# Altium project BT_BMS.PrjPcb
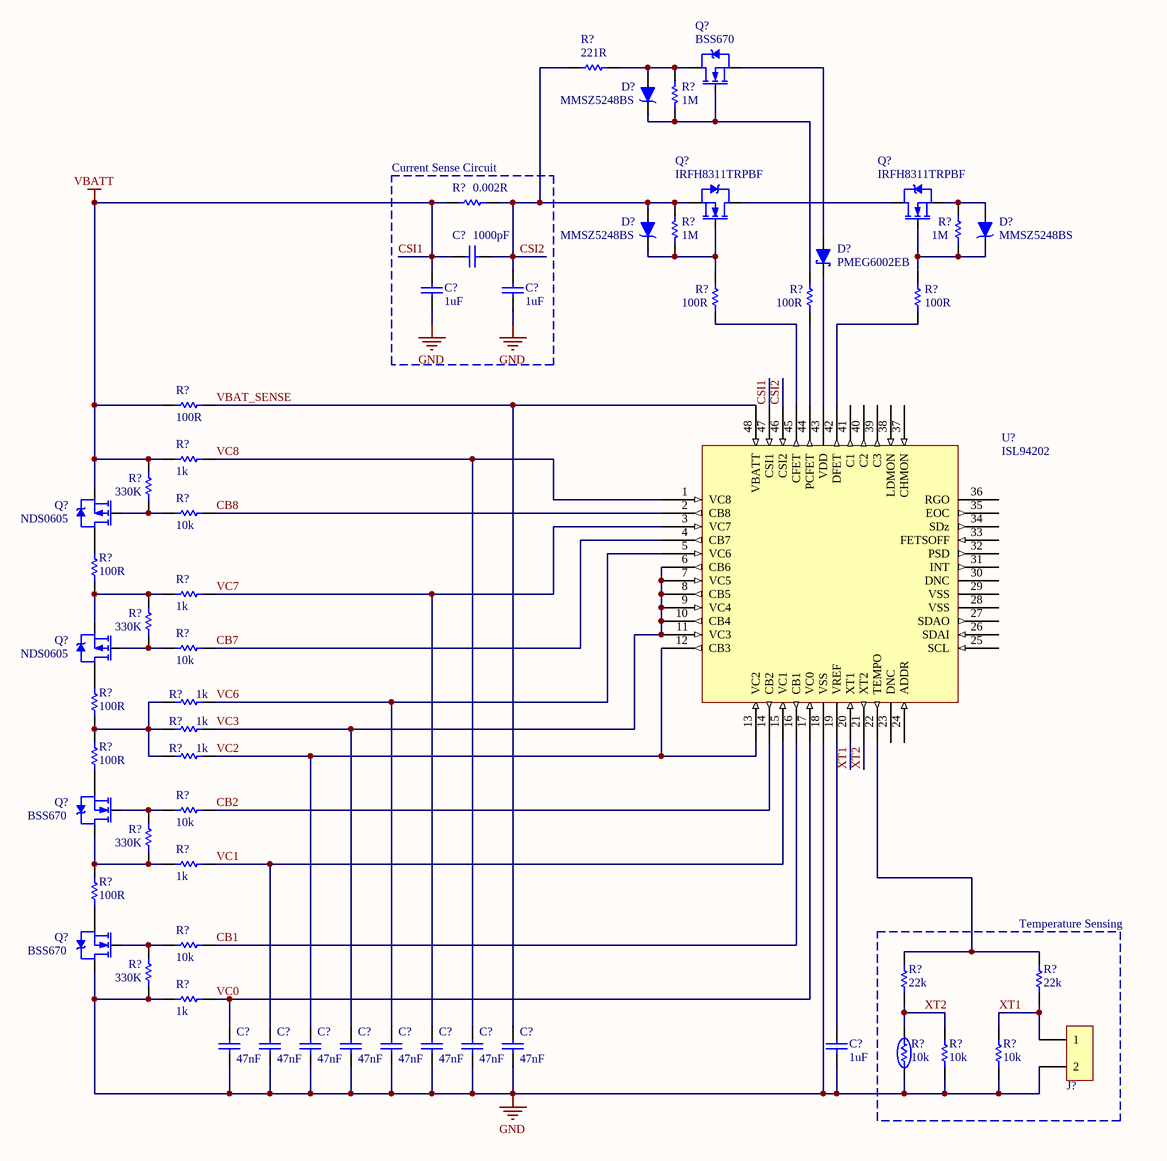
[diagram p0: Protection.SchDoc]
1 sheet, 58 parts. Net scope: global (net labels, ports and power ports of the same name join across sheets).

## Sheet Protection.SchDoc
size A3

### Parts
(Parts that share a designator on the sheet are numbered #1, #2 ... from top to bottom, then left to right.)
C?#1  1000pF  [CAPC1608X09N]
C?#2  1uF  [CAPC1608X09N]
C?#3  1uF  [CAPC1608X09N]
C?#4  47nF  [CAPC1608X09N]
C?#5  47nF  [CAPC1608X09N]
C?#6  47nF  [CAPC1608X09N]
C?#7  47nF  [CAPC1608X09N]
C?#8  47nF  [CAPC1608X09N]
C?#9  47nF  [CAPC1608X09N]
C?#10  47nF  [CAPC1608X09N]
C?#11  47nF  [CAPC1608X09N]
C?#12  1uF  [CAPC1608X09N]
D?#1  MMSZ5248BS  [SOD323-DIODES-INCORPORATED-MMSZ5248]
D?#2  MMSZ5248BS  [SOD323-DIODES-INCORPORATED-MMSZ5248]
D?#3  MMSZ5248BS  [SOD323-DIODES-INCORPORATED-MMSZ5248]
D?#4  PMEG6002EB  [SODFL160X65-2N]
J?  2POS THRU HOLE 2.54MM  [070543-0001]  (value not drawn)
Q?#1  BSS670  [SOT95P237X110-3N]
Q?#2  IRFH8311TRPBF  [8-TQFN Exposed Pad]
Q?#3  IRFH8311TRPBF  [8-TQFN Exposed Pad]
Q?#4  NDS0605  [SOT95P237X110-3N]
Q?#5  NDS0605  [SOT95P237X110-3N]
Q?#6  BSS670  [SOT95P237X110-3N]
Q?#7  BSS670  [SOT95P237X110-3N]
R?#1  221R  [RESC3216X07N]
R?#2  1M  [RESC1608X06N]
R?#3  0.002R  [RESC3216X07N]
R?#4  1M  [RESC1608X06N]
R?#5  1M  [RESC1608X06N]
R?#6  100R  [RESC1608X06N]
R?#7  100R  [RESC1608X06N]
R?#8  100R  [RESC1608X06N]
R?#9  100R  [RESC1608X06N]
R?#10  1k  [RESC1608X06N]
R?#11  330K  [RESC1608X06N]
R?#12  10k  [RESC1608X06N]
R?#13  100R  [RESC3216X07N]
R?#14  1k  [RESC1608X06N]
R?#15  330K  [RESC1608X06N]
R?#16  10k  [RESC1608X06N]
R?#17  1k  [RESC1608X06N]
R?#18  100R  [RESC3216X07N]
R?#19  1k  [RESC1608X06N]
R?#20  1k  [RESC1608X06N]
R?#21  100R  [RESC3216X07N]
R?#22  10k  [RESC1608X06N]
R?#23  330K  [RESC1608X06N]
R?#24  1k  [RESC1608X06N]
R?#25  100R  [RESC3216X07N]
R?#26  10k  [RESC1608X06N]
R?#27  330K  [RESC1608X06N]
R?#28  1k  [RESC1608X06N]
R?#29  22k  [RESC1608X06N]
R?#30  22k  [RESC1608X06N]
R?#31  10k  [RESC1608X06N]
R?#32  10k  [RESC1608X06N]
R?#33  10k  [RESC1608X06N]
U?  ISL94202

### Blocks framed on the sheet
Current Sense Circuit: C?#1-C?#3 R?#3
Temperature Sensing: J? R?#29-R?#33

### Nets
CSI1: C?#1.1 C?#2.2 Q?#4.2(S) R?#3.1 R?#9.2 R?#10.1 R?#11.2 U?.47(CSI1)  [also labelled VBATT]
GND: C?#2.1 C?#3.1 C?#4.1 C?#5.1 C?#6.1 C?#7.1 C?#8.1 C?#9.1 C?#10.1 C?#11.1 C?#12.1 J?.2 Q?#7.3(D) R?#27.1 R?#28.1 R?#31.1 R?#32.1 R?#33.1 U?.18(VSS)
CB1: R?#26.1 U?.16(CB1)
CB2: R?#22.1 U?.14(CB2)
CB7: R?#16.1 U?.4(CB7)
CB8: R?#12.1 U?.2(CB8)
CSI2: C?#1.2 C?#3.2 D?#2.2 Q?#2.2(S) R?#1.1 R?#3.2 R?#4.2 U?.46(CSI2)
VBAT_SENSE: C?#11.2 R?#9.1 U?.48(VBATT)
VC0: C?#4.2 R?#28.2 U?.17(VC0)
VC1: C?#5.2 R?#24.2 U?.15(VC1)
VC2: C?#6.2 R?#20.2 U?.12(CB3) U?.13(VC2)
VC3: C?#7.2 R?#19.2 U?.6(CB6) U?.7(VC5) U?.8(CB5) U?.9(VC4) U?.10(CB4) U?.11(VC3)
VC6: C?#8.2 R?#17.2 U?.5(VC6)
VC7: C?#9.2 R?#14.2 U?.3(VC7)
VC8: C?#10.2 R?#10.2 U?.1(VC8)
XT1: J?.1 R?#30.1 R?#33.2 U?.20(XT1)
XT2: R?#29.1 R?#31.2 R?#32.2 U?.21(XT2)
NetC?#12_2: C?#12.2 U?.19(VREF)
NetD?#1_1: D?#1.1 Q?#1.1(G) R?#2.1 R?#6.1
NetD?#1_2: D?#1.2 Q?#1.3(D) R?#1.2 R?#2.2
NetD?#2_1: D?#2.1 Q?#2.1(G) R?#4.1 R?#7.2
NetD?#3_1: D?#3.1 Q?#3.1(G) R?#5.1 R?#8.2
NetD?#3_2: D?#3.2 Q?#3.2(S) R?#5.2
NetD?#4_1: D?#4.1 U?.43(VDD)
NetD?#4_2: D?#4.2 Q?#1.2(S)
NetQ?#2_3: Q?#2.3(D) Q?#3.3(D)
NetQ?#4_1: Q?#4.1(G) R?#11.1 R?#12.2
NetQ?#4_3: Q?#4.3(D) R?#13.2
NetQ?#5_1: Q?#5.1(G) R?#15.1 R?#16.2
NetQ?#5_2: Q?#5.2(S) R?#13.1 R?#14.1 R?#15.2
NetQ?#5_3: Q?#5.3(D) R?#18.2
NetQ?#6_1: Q?#6.1(G) R?#22.2 R?#23.2
NetQ?#6_2: Q?#6.2(S) R?#21.1
NetQ?#6_3: Q?#6.3(D) R?#23.1 R?#24.1 R?#25.2
NetQ?#7_1: Q?#7.1(G) R?#26.2 R?#27.2
NetQ?#7_2: Q?#7.2(S) R?#25.1
NetR?#6_2: R?#6.2 U?.44(PCFET)
NetR?#7_1: R?#7.1 U?.45(CFET)
NetR?#8_1: R?#8.1 U?.42(DFET)
NetR?#17_1: R?#17.1 R?#18.1 R?#19.1 R?#20.1 R?#21.2
NetR?#29_2: R?#29.2 R?#30.2 U?.22(TEMPO)

Not connected (* = marked no-connect by the designer): U? 23(DNC) 24(ADDR) 25(SCL) 26(SDAI) 27(SDAO) 28(VSS) 29(VSS) 30(DNC) 31(INT) 32(PSD) 33(FETSOFF) 34(SDz) 35(EOC) 36(RGO) 37(CHMON) 38(LDMON) 39(C3) 40(C2) 41(C1)

### Library data of the parts
C?#1 = CAP CER 1000PF 50V C0G/NP0 0603: Manufacturer: Murata; Manufacturer Part Number: GRM1885C1H102JA01D; Rating: C0G; Value: 1000pF; Digikey Part Number: 490-1451-1-ND; Voltage: 50V
C?#2 C?#3 C?#12 = CAP CER 1UF 35V X7R 0603: Manufacturer: Murata; Manufacturer Part Number: GRM188R7YA105MA12D; Tolerance: 20%; Value: 1uF; Digikey Part Number: 490-10488-1-ND; Voltage: 35V; Rating: X7R
C?#4-C?#11 = CAP CER 0.047UF 50V X7R 0603: Manufacturer: Murata; Manufacturer Part Number: GRM188R71H473KA61J; Tolerance: 10%; Value: 47nF; Digikey Part Number: 490-6436-1-ND; Voltage: 50V; Rating: X7R
D?#1-D?#3 = DIODE ZENER 18V 200MW: Configuration: Single; Type: ZENER; Footprint: SOD323; Voltage: 18V; Digikey Part Number: MMSZ5248BS-FDICT-ND; Value: MMSZ5248BS
D?#4 = DIODE SCHOTTKY 60V 200MA: Configuration: Single; Type: Schottky; Footprint: SOD523; Voltage: 60V; Current: 200mA; Digikey Part Number: 1727-5843-1-ND; Value: PMEG6002EB
Q?#1 Q?#6 Q?#7 = MOSFET N-CH 55V 540MA SOT23: Manufacturer: Infineon Technologies; VDS: 50V; Rds On (Max): 650 mOhm @ 270mA, 10V; Vth: 2V; Power Dissipation (Max): 360mW; Vgs (max): 20V; Digikey Part Number: BSS670S2LH6327XTSA1CT-ND; Value: BSS670; Max Current: 540mA
Q?#2 Q?#3 = MOSFET N CH 30V 32A PQFN5X6: Manufacturer: Infineon Technologies; Rds On (Max): 2.1 mOhm @ 20A, 10V; Vth: 2.35V @ 100µA; Power Dissipation (Max): 3.6W; Vgs (max): ±20V; Digikey Part Number: IRFH8311TRPBFCT-ND; VDS: 30V; Value: IRFH8311TRPBF; Max Current: 32A
Q?#4 Q?#5 = MOSFET P-CH 60V 180MA SOT-23: Manufacturer: Fairchild/ON Semiconductor; Rds On (Max): 5 Ohm @ 500mA, 10V; Vth: 3V @ 250µA; Power Dissipation (Max): 360mW; Vgs (max): ±20V; Digikey Part Number: NDS0605CT-ND; VDS: 60V; Value: NDS0605; Max Current: 180mA
R?#1 = RES SMD 221 OHM 1% 1/2W 1206: Manufacturer: Stackpole Electronics Inc.; Power: 0.5W; Footprint: 1206; Tolerance: 1%; Value: 221R; Digikey Part Number: RNCP1206FTD221RCT-ND
R?#2 R?#4 R?#5 = RES 1M 0603: Tolerance: 1%; Power: 0.1W; Footprint: 0603; Value: 1M; Digikey Part Number: 311-1.00MHRCT-ND
R?#3 = RES SMD 0.002 OHM 1% 1W 1206: Manufacturer: Stackpole Electronics Inc.; Footprint: 1206; Tolerance: 1%; Power: 1W; Value: 0.002R; Digikey Part Number: CSNL1206FT2L00CT-ND
R?#6-R?#9 = RES SMD 100 OHM 1% 1/10W 0603: Manufacturer: Yageo; Manufacturer Part Number: RC0603FR-07100RL; Power: 0.1W; Type: RES; Footprint: 0603; Tolerance: 1%; Digikey Part Number: 311-100HRCT-ND; Value: 100R
R?#10 R?#14 R?#17 R?#19 R?#20 R?#24 R?#28 = RES SMD 1K OHM 1% 1/10W 0603: Manufacturer: Yageo; Manufacturer Part Number: RC0603FR-071KL; Power: 0.1W; Type: RES; Footprint: 0603; Tolerance: 1%; Temperature: 155dC; Digikey Part Number: 311-1.00KHRCT-ND; Value: 1k
R?#11 R?#15 R?#23 R?#27 = RES SMD 330K OHM 1% 1/10W 0603: Manufacturer: Yageo; Manufacturer Part Number: RC0603FR-07330KL; Power: 0.1W; Type: RES; Footprint: 0603; Tolerance: 1%; Temperature: 155dC; Digikey Part Number: 311-330KHRCT-ND; Value: 330K
R?#12 R?#16 R?#22 R?#26 R?#32 R?#33 = RES SMD 10K OHM 1% 1/10W 0603: Manufacturer: Yageo; Manufacturer Part Number: RC0603FR-0710KL; Power: 0.1W; Type: RES; Footprint: 0603; Tolerance: 1%; Temperature: 155dC; Digikey Part Number: 311-10.0KHRCT-ND; Value: 10k
R?#13 R?#18 R?#21 R?#25 = RES SMD 100 OHM 1% 1/2W 1206: Manufacturer: Stackpole Electronics Inc.; Power: 0.5W; Footprint: 1206; Tolerance: 1%; Value: 100R; Digikey Part Number: RNCP1206FTD100RCT-ND
R?#29 R?#30 = RES SMD 22K OHM 1% 1/10W 0603: Manufacturer: Yageo; Manufacturer Part Number: RC0603FR-0722KL; Power: 0.1W; Type: RES; Footprint: 0603; Tolerance: 1%; Digikey Part Number: 311-22.0KHRCT-ND; Value: 22k
R?#31 = NTC Thermistor 10k (0603 Metric): NTC THERMISTOR 10K OHM 1% 0603; Manufacturer: Murata Electronics North America; Manufacturer Part Number: NCP03XH103F05RL; Power: 100mW; Type: RES; Footprint: 0603; Tolerance: 1%; Value: 10k; Digikey Part Number: 490-11806-1-ND
U? = ISL94202IRTZ: IC MULTI BATTERY MONITOR 48TQFN; Manufacturer: Intersil; Digikey Part Number: ISL94202IRTZ-T7ACT-ND; Value: ISL94202; Footprint: TQFN (6x6)